# EasyEDA schematic SCH_Test-Platte-Base_2025-10-24.json
TITLE: Sheet_1; REV: 1.0; Date: 2025-10-13; Sheet: 1/1; Drawn By: snoms; Company: Your Company
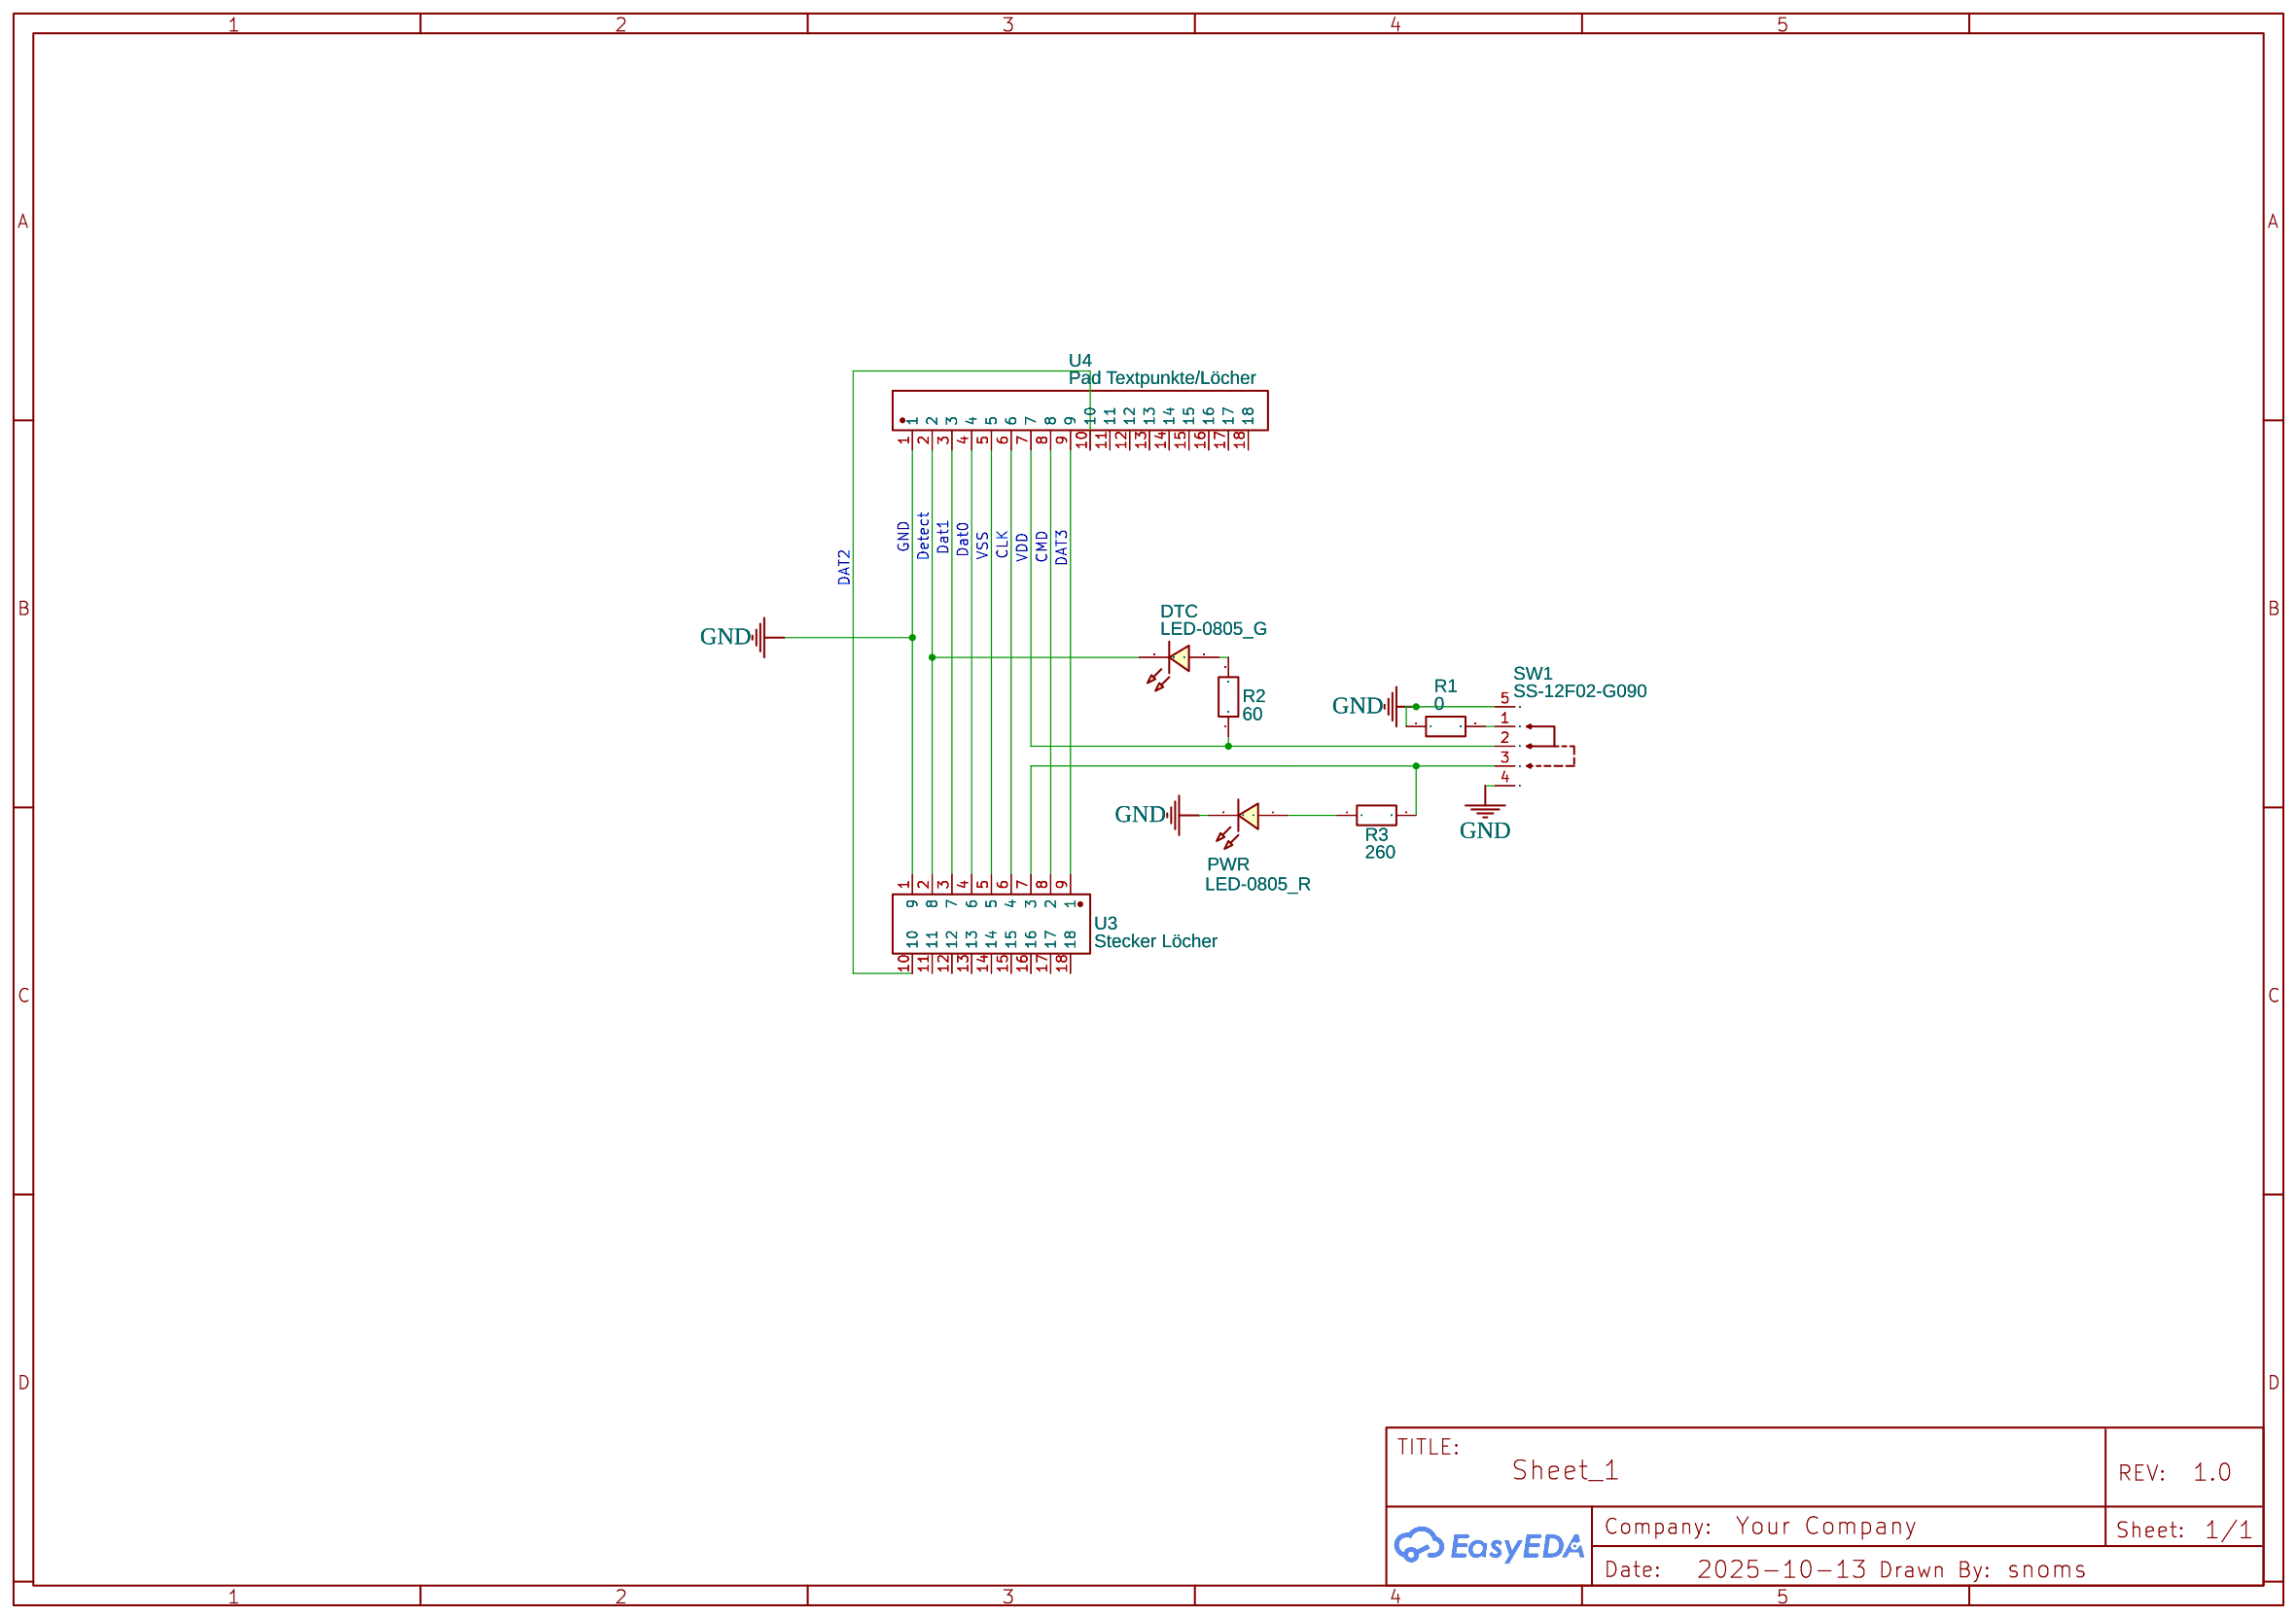
[diagram p0: schematic sheet]

## Parts
DTC  LED-0805_G  [LED0805_GREEN]
PWR  LED-0805_R  [LED0805_RED]
R1  0  [R0805]
R2  60  [R0805]
R3  260  [R0805]
SW1  SS-12F02-G090  [SW-TH_G-SWITCH_SS-12F02-G090]
U3  Stecker Löcher  [STECKER VERTIKAL]
U4  Pad Textpunkte/Löcher  [FOOTPRINT PAD/LÖCHER]

## Library data of the parts
DTC = LED-0805_G: Manufacturer: Hubei KENTO Elec; Manufacturer Part: KT-0805G; Supplier Part: C2297; Contributor: LCEDA_Lib
PWR = LED-0805_R: Manufacturer: ARKLED; Manufacturer Part: D-R080508L3-KS2; Supplier Part: C130114; Contributor: LCEDA_Lib
R1-R3 = R_0805_EU: Contributor: LCEDA_Lib
SW1 = SS-12F02-G090: Contributor: LCSC; Supplier: LCSC; Supplier Part: C2848916; Manufacturer: G-Switch(品赞); JLCPCB Part Class: Extended Part
U3 = Stecker Löcher: Supplier Part: C5173293; Contributor: snoms
U4 = Pad Textpunkte/Löcher: Contributor: snoms

## Nets
GND: PWR.2 R1.1 SW1.4 SW1.5 U3.1(9) U4.1
Net-(DTC-1): DTC.1 R2.2
Net-(DTC-2): DTC.2 U3.2(8) U4.2
Net-(PWR-1): PWR.1 R3.1
Net-(R1-2): R1.2 SW1.1
Net-(R2-1): R2.1 SW1.2 U4.7
Net-(R3-2): R3.2 SW1.3 U3.7(3)
Net-(U3-3): U3.3(7) U4.3
Net-(U3-4): U3.4(6) U4.4
Net-(U3-5): U3.5 U4.5
Net-(U3-6): U3.6(4) U4.6
Net-(U3-8): U3.8(2) U4.8
Net-(U3-9): U3.9(1) U4.9
Net-(U3-10): U3.10 U4.10

Not connected (* = marked no-connect by the designer): U3 11 12 13 14 15 16 17 18; U4 11 12 13 14 15 16 17 18

## Notes on the sheet
- GND
- Detect
- Dat1
- Dat0
- VSS
- CLK
- VDD
- CMD
- DAT3
- DAT2
